# Altium schematic sheet Sheet1.SchDoc
size A3
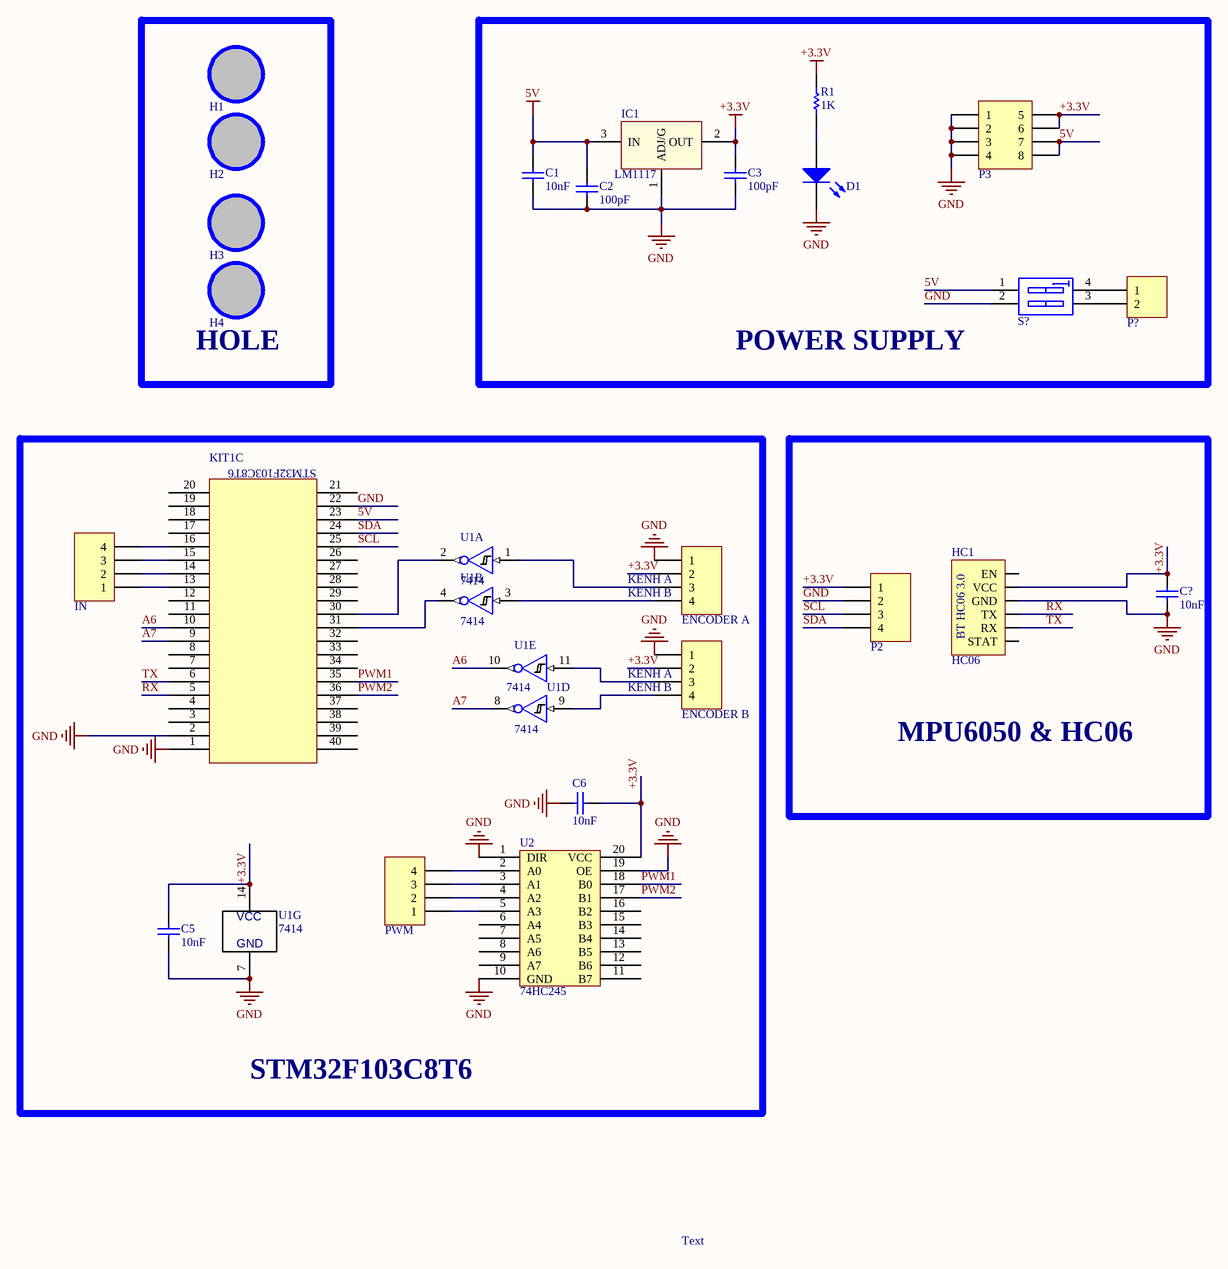
[diagram p0: Sheet1.SchDoc]

## Parts
C1  value 10nF  [CAP-SM-0805]  (hidden comment: Cap Non-Pol SMD)
C2  value 100pF  [CAP-SM-0805]  (hidden comment: Cap Non-Pol SMD)
C3  value 100pF  [CAP-SM-0805]  (hidden comment: Cap Non-Pol SMD)
C5  value 10nF  [CAP-SM-0805]  (hidden comment: Cap Non-Pol SMD)
C6  value 10nF  [CAP-SM-0805]  (hidden comment: Cap Non-Pol SMD)
C?  value 10nF  [CAP-SM-0805]  (hidden comment: Cap Non-Pol SMD)
D1  LED  [LED-3mm]  (value not drawn)
ENCODER_A  Header 4  [JP4]  (value not drawn)
ENCODER_B  Header 4  [JP4]  (value not drawn)
H1  Hole  [LO KHOAN 3MM]  (value not drawn)
H2  Hole  [LO KHOAN 3MM]  (value not drawn)
H3  Hole  [LO KHOAN 3MM]  (value not drawn)
H4  Hole  [LO KHOAN 3MM]  (value not drawn)
HC1  HC06  [HC06]
IC1  LM1117  [SOT223-4N]
IN  Header 4  [JP4]  (value not drawn)
KIT1  STM  [STM32F103C8T6]  (value not drawn)  (part C of 3)
P2  Header 4  [JP4]  (value not drawn)
P3  Header 4X2  [JP4x2]  (value not drawn)
P?  Domino 2  [DOMINO 2- 5mm]  (value not drawn)
PWM  Header 4  [JP4]  (value not drawn)
R1  value 1K  [RES 1/2W]  (hidden comment: RESISTOR)
S?  SW - DIP2  [SWDIP-2]  (value not drawn)
U1  7414  [SO14]  (parts A,B,D,E,G of 7)
U2  74HC245  [DIP20/W0.3]

## Blocks framed on the sheet
HOLE: H1-H4
POWER SUPPLY: C1-C3 D1 IC1 P3 P? R1 S?
STM32F103C8T6: C5 C6 ENCODER_A ENCODER_B IN KIT1 PWM U1 U2
MPU6050 & HC06: C? HC1 P2

## Nets
5V: C1.2 C2.2 IC1.3(IN) KIT1.23 P3.7 P3.8 S?.1(A1)
+3.3V: C3.2 C5.1 C6.2 C?.2 ENCODER_A.2 ENCODER_B.2 HC1.5(VCC) IC1.2(OUT) P2.1 P3.5 P3.6 R1.2 U1.14(VCC) U2.20(VCC)
GND: C1.1 C2.1 C3.1 C5.2 C6.1 C?.1 D1.2(K) ENCODER_A.1 ENCODER_B.1 HC1.4(GND) IC1.1(ADJ/G) KIT1.1 KIT1.2 KIT1.22 P2.2 P3.1 P3.2 P3.3 P3.4 S?.2(A2) U1.7(GND) U2.1(DIR) U2.10(GND) U2.19(OE)
A6: KIT1.10 U1.10(Y)
A7: KIT1.9 U1.8(Y)
PWM1: KIT1.35 U2.18(B0)
PWM2: KIT1.36 U2.17(B1)
RX: HC1.3(TX) KIT1.5
SCL: KIT1.25 P2.3
SDA: KIT1.24 P2.4
TX: HC1.2(RX) KIT1.6
NetD1_1: D1.1(A) R1.1
NetENCODER_A_3: ENCODER_A.3 U1.1(A)
NetENCODER_A_4: ENCODER_A.4 U1.3(A)
NetENCODER_B_3: ENCODER_B.3 U1.11(A)
NetENCODER_B_4: ENCODER_B.4 U1.9(A)
NetIN_1: IN.1 KIT1.13
NetIN_2: IN.2 KIT1.14
NetIN_3: IN.3 KIT1.15
NetIN_4: IN.4 KIT1.16
NetKIT1_30: KIT1.30 U1.2(Y)
NetKIT1_31: KIT1.31 U1.4(Y)
NetP?_1: P?.1 S?.4(A4)
NetP?_2: P?.2 S?.3(A3)
NetPWM_1: PWM.1 U2.5(A3)
NetPWM_2: PWM.2 U2.4(A2)
NetPWM_3: PWM.3 U2.3(A1)
NetPWM_4: PWM.4 U2.2(A0)

Not connected (* = marked no-connect by the designer): H1 1; H2 1; H3 1; H4 1; HC1 1(STAT) 6(EN); KIT1 3 4 7 8 11 12 17 18 19 20 21 26 27 28 29 32 33 34 37 38 39 40; U2 6(A4) 7(A5) 8(A6) 9(A7) 11(B7) 12(B6) 13(B5) 14(B4) 15(B3) 16(B2)

## Notes on the sheet
- (near ENCODER_A) KENH A
- (near ENCODER_A) KENH B
- (near ENCODER_B) KENH A
- (near ENCODER_B) KENH B
- Text
- (in symbol HC06) BT HC06 3.0

## Library data of the parts
C1-C3 C5 C6 C? = Cap Non-Pol SMD: Capacitor
ENCODER_A ENCODER_B IN P2 PWM = Header 4: Header, 4-Pin; LatestRevisionDate: 17-Jul-2002; LatestRevisionNote: Re-released for DXP Platform.; Publisher: Altium Limited
H1-H4 = Hole: Hole 3mm
HC1 = HC06: Manufacturer: W¨¹rth Elektronik eiSos GmbH; partNo: 613004143121; ComponentLink1 Description: Manufacturer; ComponentLink2 Description: Datasheet; NoPins: 04; Created Date: 29 March 2013; ComponentLink1URL: http://www.we-online.com; ComponentLink2URL: http://katalog.we-online.de/em/datasheet/6130xx143121.pdf; Created by: Karrer Zheng
IC1 = LM1117: Available in 1.8V, 2.5V, 2.85V, 3.3V, 5V, and  Adjustable Versions; Value: LM317
KIT1 = STM32F103C8T6: STM32 Development Board
P3 = Header 4X2: Header, 4-Pin, Dual row; LatestRevisionDate: 17-Jul-2002; LatestRevisionNote: Re-released for DXP Platform.; Publisher: Altium Limited
P? = Domino 2: Domino, 2-Pin; LatestRevisionDate: 17-Jul-2002; LatestRevisionNote: Re-released for DXP Platform.; Publisher: Altium Limited
S? = SWDIP-2: DIP Switch, 2 Position, SPST; Link: *
U1 = 7414: IC, M74HC04M, Hex Inverter, SO-14; Text Field1: ST; Text Field2: M74HC04M1R; Text Field3: Mouser; Text Field4: 511-M74HC04M; Text Field6: .22; Text Field5: SO-14; NI?: *; O?: *; Section:: *
U2 = 74HC245: Octal bus tranceiver